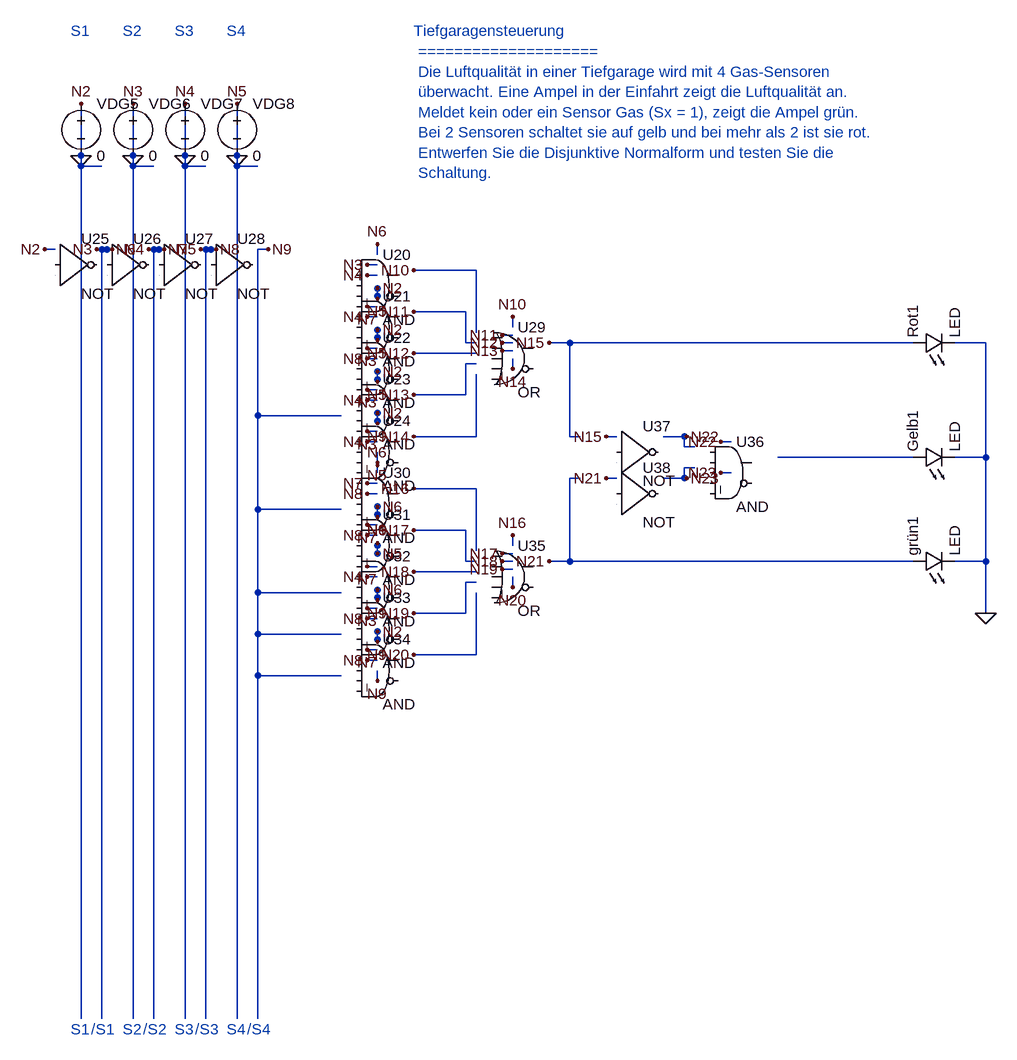
[diagram p0: schematic 2_1_Tiefgaragensteuerung_Lsg.asc]
2_1_Tiefgaragensteuerung_Lsg.asc, the LTspice schematic file:
Version 4
SHEET 1 880 680
WIRE 1504 496 1536 496
WIRE 1504 672 1536 672
WIRE 1504 832 1536 832
WIRE 192 224 160 224
WIRE 272 224 240 224
WIRE 320 400 320 224
WIRE 400 416 400 224
WIRE 192 368 192 352
WIRE 272 448 272 352
WIRE 320 464 320 400
WIRE 400 480 400 416
WIRE 160 496 160 432
WIRE 240 512 240 384
WIRE 352 528 352 352
WIRE 400 544 400 480
WIRE 160 560 160 496
WIRE 240 576 240 512
WIRE 320 592 320 464
WIRE 432 608 432 352
WIRE 560 608 432 608
WIRE 160 624 160 560
WIRE 240 640 240 576
WIRE 320 656 320 592
WIRE 400 672 400 544
WIRE 768 480 768 384
WIRE 768 384 688 384
WIRE 768 496 752 496
WIRE 752 496 752 448
WIRE 752 448 688 448
WIRE 768 512 688 512
WIRE 768 528 752 528
WIRE 752 528 752 576
WIRE 752 576 688 576
WIRE 768 544 768 640
WIRE 768 640 688 640
WIRE 768 816 768 720
WIRE 768 720 688 720
WIRE 768 832 752 832
WIRE 752 832 752 784
WIRE 752 784 688 784
WIRE 768 848 688 848
WIRE 768 864 752 864
WIRE 752 864 752 912
WIRE 752 912 688 912
WIRE 768 880 768 976
WIRE 768 976 688 976
WIRE 192 704 192 368
WIRE 272 720 272 448
WIRE 352 736 352 528
WIRE 432 752 432 608
WIRE 560 752 432 752
WIRE 192 768 192 704
WIRE 272 784 272 720
WIRE 352 800 352 736
WIRE 192 832 192 768
WIRE 272 848 272 784
WIRE 432 880 432 752
WIRE 560 880 432 880
WIRE 352 928 352 800
WIRE 432 944 432 880
WIRE 560 944 432 944
WIRE 560 1008 432 1008
WIRE 1056 640 1088 640
WIRE 1088 640 1088 656
WIRE 1088 656 1104 656
WIRE 1056 704 1088 704
WIRE 1088 704 1088 688
WIRE 1088 688 1104 688
WIRE 928 640 912 640
WIRE 912 640 912 496
WIRE 1536 496 1552 496
WIRE 1552 496 1552 672
WIRE 1552 672 1552 832
WIRE 1536 672 1552 672
WIRE 1552 832 1552 912
WIRE 1536 832 1552 832
WIRE 928 704 912 704
WIRE 912 704 912 832
WIRE 160 224 160 432
WIRE 160 128 160 224
WIRE 240 224 240 384
WIRE 240 128 240 224
WIRE 320 224 352 224
WIRE 320 128 320 224
WIRE 400 224 432 224
WIRE 400 128 400 224
WIRE 160 960 160 624
WIRE 160 1536 160 960
WIRE 192 896 192 832
WIRE 192 1536 192 896
WIRE 240 912 240 640
WIRE 240 1536 240 912
WIRE 272 976 272 848
WIRE 272 1536 272 976
WIRE 320 864 320 656
WIRE 320 1536 320 864
WIRE 352 992 352 928
WIRE 352 1536 352 992
WIRE 400 816 400 672
WIRE 400 1536 400 816
WIRE 432 1008 432 944
WIRE 432 1536 432 1008
WIRE 912 496 896 496
WIRE 1440 496 912 496
WIRE 1440 672 1232 672
WIRE 912 832 896 832
WIRE 1440 832 912 832
WIRE 616 952 616 940
WIRE 616 616 616 604
WIRE 616 552 616 540
WIRE 616 488 616 476
WIRE 616 424 616 412
WIRE 120 352 104 352
WIRE 616 904 600 904
WIRE 616 632 600 632
WIRE 616 568 600 568
WIRE 616 504 600 504
WIRE 616 376 600 376
WIRE 200 352 184 352
WIRE 616 856 600 856
WIRE 616 648 600 648
WIRE 616 584 600 584
WIRE 616 456 600 456
WIRE 616 392 600 392
WIRE 280 352 264 352
WIRE 616 808 616 820
WIRE 616 664 616 680
WIRE 616 536 616 556
WIRE 616 472 616 492
WIRE 616 408 616 428
WIRE 360 352 344 352
WIRE 616 888 616 876
WIRE 616 824 616 804
WIRE 616 760 616 748
WIRE 616 696 616 684
WIRE 192 352 208 352
WIRE 616 360 616 344
WIRE 616 968 600 968
WIRE 616 840 600 840
WIRE 616 776 600 776
WIRE 616 712 600 712
WIRE 272 352 288 352
WIRE 616 440 600 440
WIRE 616 984 600 984
WIRE 616 920 600 920
WIRE 616 792 600 792
WIRE 616 728 600 728
WIRE 352 352 368 352
WIRE 616 520 600 520
WIRE 616 1000 616 1016
WIRE 616 936 616 956
WIRE 616 872 616 892
WIRE 616 744 616 764
WIRE 432 352 448 352
WIRE 616 600 616 620
WIRE 824 472 824 456
WIRE 688 384 672 384
WIRE 824 484 808 484
WIRE 688 448 672 448
WIRE 824 496 808 496
WIRE 688 512 672 512
WIRE 824 508 808 508
WIRE 688 576 672 576
WIRE 824 520 824 536
WIRE 688 640 672 640
WIRE 984 640 968 640
WIRE 896 496 880 496
WIRE 824 808 824 792
WIRE 688 720 672 720
WIRE 824 820 808 820
WIRE 688 784 672 784
WIRE 824 832 808 832
WIRE 688 848 672 848
WIRE 824 844 808 844
WIRE 688 912 672 912
WIRE 824 856 824 872
WIRE 688 976 672 976
WIRE 984 704 968 704
WIRE 896 832 880 832
WIRE 1056 640 1092 640
WIRE 1160 648 1144 648
WIRE 1056 704 1092 704
WIRE 1160 696 1144 696
FLAG 160 208 0
FLAG 240 208 0
FLAG 320 208 0
FLAG 400 208 0
FLAG 1552 912 0
FLAG 616 940 N2
FLAG 616 604 N2
FLAG 616 540 N2
FLAG 616 476 N2
FLAG 616 412 N2
FLAG 104 352 N2
FLAG 160 128 N2
FLAG 600 904 N3
FLAG 600 632 N3
FLAG 600 568 N3
FLAG 600 504 N3
FLAG 600 376 N3
FLAG 184 352 N3
FLAG 240 128 N3
FLAG 600 856 N4
FLAG 600 648 N4
FLAG 600 584 N4
FLAG 600 456 N4
FLAG 600 392 N4
FLAG 264 352 N4
FLAG 320 128 N4
FLAG 616 820 N5
FLAG 616 680 N5
FLAG 616 556 N5
FLAG 616 492 N5
FLAG 616 428 N5
FLAG 344 352 N5
FLAG 400 128 N5
FLAG 616 876 N6
FLAG 616 804 N6
FLAG 616 748 N6
FLAG 616 684 N6
FLAG 208 352 N6
FLAG 616 344 N6
FLAG 600 968 N7
FLAG 600 840 N7
FLAG 600 776 N7
FLAG 600 712 N7
FLAG 288 352 N7
FLAG 600 440 N7
FLAG 600 984 N8
FLAG 600 920 N8
FLAG 600 792 N8
FLAG 600 728 N8
FLAG 368 352 N8
FLAG 600 520 N8
FLAG 616 1016 N9
FLAG 616 956 N9
FLAG 616 892 N9
FLAG 616 764 N9
FLAG 448 352 N9
FLAG 616 620 N9
FLAG 824 456 N10
FLAG 672 384 N10
FLAG 808 484 N11
FLAG 672 448 N11
FLAG 808 496 N12
FLAG 672 512 N12
FLAG 808 508 N13
FLAG 672 576 N13
FLAG 824 536 N14
FLAG 672 640 N14
FLAG 968 640 N15
FLAG 880 496 N15
FLAG 824 792 N16
FLAG 672 720 N16
FLAG 808 820 N17
FLAG 672 784 N17
FLAG 808 832 N18
FLAG 672 848 N18
FLAG 808 844 N19
FLAG 672 912 N19
FLAG 824 872 N20
FLAG 672 976 N20
FLAG 968 704 N21
FLAG 880 832 N21
FLAG 1092 640 N22
FLAG 1144 648 N22
FLAG 1092 704 N23
FLAG 1144 696 N23
SYMBOL Digital\and 616 344 R0
SYMATTR InstName U20
SYMATTR Value AND
SYMATTR LibreSpice gate=and;inputs=4;vth=2.5;vhigh=5;pins=In1,In2,In3,In4,Out
SYMBOL Digital\and 616 408 R0
SYMATTR InstName U21
SYMATTR Value AND
SYMATTR LibreSpice gate=and;inputs=4;vth=2.5;vhigh=5;pins=In1,In2,In3,In4,Out
SYMBOL Digital\and 616 472 R0
SYMATTR InstName U22
SYMATTR Value AND
SYMATTR LibreSpice gate=and;inputs=4;vth=2.5;vhigh=5;pins=In1,In2,In3,In4,Out
SYMBOL Digital\and 616 536 R0
SYMATTR InstName U23
SYMATTR Value AND
SYMATTR LibreSpice gate=and;inputs=4;vth=2.5;vhigh=5;pins=In1,In2,In3,In4,Out
SYMBOL Digital\and 616 600 R0
SYMATTR InstName U24
SYMATTR Value AND
SYMATTR LibreSpice gate=and;inputs=4;vth=2.5;vhigh=5;pins=In1,In2,In3,In4,Out
SYMBOL Digital\inv 120 312 R0
SYMATTR InstName U25
SYMATTR Value NOT
SYMATTR LibreSpice gate=not;inputs=1;vth=2.5;vhigh=5;pins=In1,Out
SYMBOL Digital\inv 200 312 R0
SYMATTR InstName U26
SYMATTR Value NOT
SYMATTR LibreSpice gate=not;inputs=1;vth=2.5;vhigh=5;pins=In1,Out
SYMBOL Digital\inv 280 312 R0
SYMATTR InstName U27
SYMATTR Value NOT
SYMATTR LibreSpice gate=not;inputs=1;vth=2.5;vhigh=5;pins=In1,Out
SYMBOL Digital\inv 360 312 R0
SYMATTR InstName U28
SYMATTR Value NOT
SYMATTR LibreSpice gate=not;inputs=1;vth=2.5;vhigh=5;pins=In1,Out
SYMBOL Digital\or 824 456 R0
SYMATTR InstName U29
SYMATTR Value OR
SYMATTR LibreSpice gate=or;inputs=5;vth=2.5;vhigh=5;pins=In1,In2,In3,In4,In5,Out
SYMBOL Digital\and 616 680 R0
SYMATTR InstName U30
SYMATTR Value AND
SYMATTR LibreSpice gate=and;inputs=4;vth=2.5;vhigh=5;pins=In1,In2,In3,In4,Out
SYMBOL Digital\and 616 744 R0
SYMATTR InstName U31
SYMATTR Value AND
SYMATTR LibreSpice gate=and;inputs=4;vth=2.5;vhigh=5;pins=In1,In2,In3,In4,Out
SYMBOL Digital\and 616 808 R0
SYMATTR InstName U32
SYMATTR Value AND
SYMATTR LibreSpice gate=and;inputs=4;vth=2.5;vhigh=5;pins=In1,In2,In3,In4,Out
SYMBOL Digital\and 616 872 R0
SYMATTR InstName U33
SYMATTR Value AND
SYMATTR LibreSpice gate=and;inputs=4;vth=2.5;vhigh=5;pins=In1,In2,In3,In4,Out
SYMBOL Digital\and 616 936 R0
SYMATTR InstName U34
SYMATTR Value AND
SYMATTR LibreSpice gate=and;inputs=4;vth=2.5;vhigh=5;pins=In1,In2,In3,In4,Out
SYMBOL Digital\or 824 792 R0
SYMATTR InstName U35
SYMATTR Value OR
SYMATTR LibreSpice gate=or;inputs=5;vth=2.5;vhigh=5;pins=In1,In2,In3,In4,In5,Out
SYMBOL Digital\and 1160 632 R0
SYMATTR InstName U36
SYMATTR Value AND
SYMATTR LibreSpice gate=and;inputs=2;vth=2.5;vhigh=5;pins=In1,In2,Out
SYMBOL Digital\inv 984 600 R0
SYMATTR InstName U37
SYMATTR Value NOT
SYMATTR LibreSpice gate=not;inputs=1;vth=2.5;vhigh=5;pins=In1,Out
SYMBOL Digital\inv 984 664 R0
SYMATTR InstName U38
SYMATTR Value NOT
SYMATTR LibreSpice gate=not;inputs=1;vth=2.5;vhigh=5;pins=In1,Out
SYMBOL LED 1440 512 R270
SYMATTR InstName Rot1
SYMATTR Value LED
SYMBOL LED 1440 688 R270
SYMATTR InstName Gelb1
SYMATTR Value LED
SYMBOL LED 1440 848 R270
SYMATTR InstName grün1
SYMATTR Value LED
SYMBOL voltage 160 112 R0
SYMATTR InstName VDG5
SYMATTR Value 0
SYMBOL voltage 240 112 R0
SYMATTR InstName VDG6
SYMATTR Value 0
SYMBOL voltage 320 112 R0
SYMATTR InstName VDG7
SYMATTR Value 0
SYMBOL voltage 400 112 R0
SYMATTR InstName VDG8
SYMATTR Value 0
TEXT 672 16 Left 2 ;Tiefgaragensteuerung \n ==================== \n Die Luftqualität in einer Tiefgarage wird mit 4 Gas-Sensoren \n überwacht. Eine Ampel in der Einfahrt zeigt die Luftqualität an. \n Meldet kein oder ein Sensor Gas (Sx = 1), zeigt die Ampel grün. \n Bei 2 Sensoren schaltet sie auf gelb und bei mehr als 2 ist sie rot. \n Entwerfen Sie die Disjunktive Normalform und testen Sie die \n Schaltung.
TEXT 144 16 Left 2 ;S1
TEXT 224 16 Left 2 ;S2
TEXT 304 16 Left 2 ;S3
TEXT 384 16 Left 2 ;S4
TEXT 144 1552 Left 2 ;S1
TEXT 224 1552 Left 2 ;S2
TEXT 304 1552 Left 2 ;S3
TEXT 384 1552 Left 2 ;S4
TEXT 176 1552 Left 2 ;/S1
TEXT 256 1552 Left 2 ;/S2
TEXT 336 1552 Left 2 ;/S3
TEXT 416 1552 Left 2 ;/S4

The netlist it stands for:
* 2_1_Tiefgaragensteuerung_Lsg.asc
A§U20 0 0 0 0 P001 0 0 0 AND AND
A§U21 P001 0 0 0 P002 0 0 0 AND AND
A§U22 P002 0 0 0 P003 0 0 0 AND AND
A§U23 P003 0 0 0 P004 0 0 0 AND AND
A§U24 P004 0 0 0 0 0 0 0 AND AND
A§U25 0 0 0 0 0 0 0 0 BUF NOT
A§U26 0 0 0 0 0 0 0 0 BUF NOT
A§U27 0 0 0 0 0 0 0 0 BUF NOT
A§U28 0 0 0 0 0 0 0 0 BUF NOT
A§U29 0 0 0 0 0 0 0 0 OR OR
A§U30 0 0 0 0 P005 0 0 0 AND AND
A§U31 P005 0 0 0 P006 0 0 0 AND AND
A§U32 P006 0 0 0 P007 0 0 0 AND AND
A§U33 P007 0 0 0 P008 0 0 0 AND AND
A§U34 P008 0 0 0 0 0 0 0 AND AND
A§U35 0 0 0 0 0 0 0 0 OR OR
A§U36 0 0 0 0 0 0 0 0 AND AND
A§U37 0 0 0 0 0 0 0 0 BUF NOT
A§U38 0 0 0 0 0 0 0 0 BUF NOT
D§Rot1 N15 0 LED
D§Gelb1 N001 0 LED
D§grün1 N21 0 LED
VDG5 0 0 0
VDG6 0 0 0
VDG7 0 0 0
VDG8 0 0 0
.model D D
.lib standard.dio
* Tiefgaragensteuerung
*  ====================
*  Die Luftqualität in einer Tiefgarage wird mit 4 Gas-Sensoren
*  überwacht. Eine Ampel in der Einfahrt zeigt die Luftqualität an.
*  Meldet kein oder ein Sensor Gas (Sx = 1), zeigt die Ampel grün.
*  Bei 2 Sensoren schaltet sie auf gelb und bei mehr als 2 ist sie rot.
*  Entwerfen Sie die Disjunktive Normalform und testen Sie die
*  Schaltung.
* S1
* S2
* S3
* S4
* S1
* S2
* S3
* S4
* /S1
* /S2
* /S3
* /S4
.backanno
.end